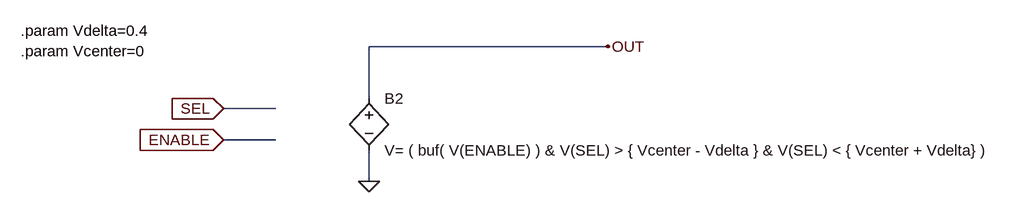
[diagram p0: schematic selector-element.asc]
selector-element.asc, the LTspice schematic file:
Version 4
SHEET 1 1108 680
WIRE 320 -400 -48 -400
WIRE -48 -320 -48 -400
WIRE -192 -304 -272 -304
WIRE -192 -256 -272 -256
WIRE -48 -192 -48 -240
FLAG -272 -304 SEL
IOPIN -272 -304 In
FLAG 320 -400 OUT
FLAG -48 -192 0
FLAG -272 -256 ENABLE
IOPIN -272 -256 In
SYMBOL bv -48 -336 R0
SYMATTR InstName B2
SYMATTR Value V= ( buf( V(ENABLE) ) & V(SEL) > { Vcenter - Vdelta } & V(SEL) < { Vcenter + Vdelta} )
TEXT -584 -424 Left 2 !.param Vdelta=0.4\n.param Vcenter=0

The netlist it stands for:
* selector-element.asc
B2 OUT 0 V= ( buf( V(ENABLE) ) & V(SEL) > { Vcenter - Vdelta } & V(SEL) < { Vcenter + Vdelta} )
.param Vdelta=0.4
.param Vcenter=0
.backanno
.end